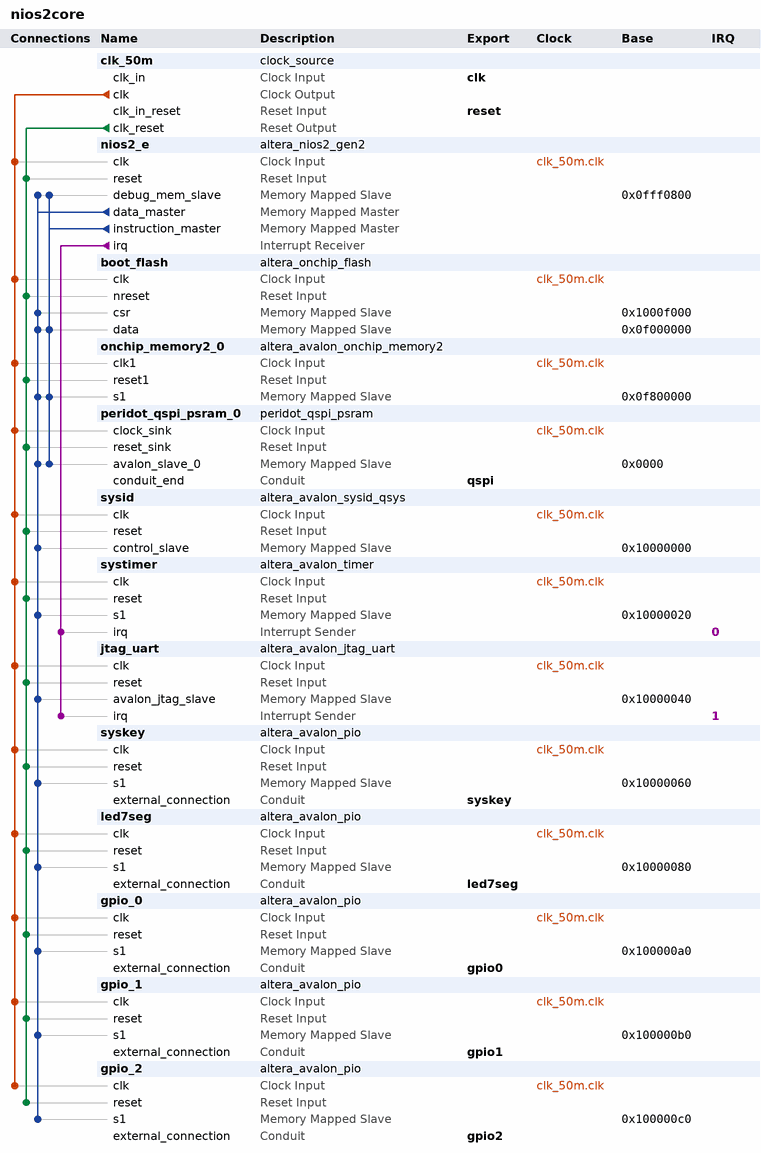
[diagram p0: system contents]
# Platform Designer (Qsys) system nios2core, MAX 10 10M08SCE144C8G
# Parameters at their usual value, and those the tool derives, are not listed.
package require -exact qsys 17.1
create_system nios2core
set_project_property DEVICE_FAMILY {MAX 10}
set_project_property DEVICE 10M08SCE144C8G

add_instance clk_50m clock_source 17.1
set_instance_parameter_value clk_50m clockFrequency 50000000

add_instance nios2_e altera_nios2_gen2 17.1
set_instance_parameter_value nios2_e dcache_size 2048
set_instance_parameter_value nios2_e exceptionSlave onchip_memory2_0.s1
set_instance_parameter_value nios2_e icache_size 4096
set_instance_parameter_value nios2_e impl Tiny
set_instance_parameter_value nios2_e resetSlave boot_flash.data

add_instance boot_flash altera_onchip_flash 17.1
set_instance_parameter_value boot_flash CONFIGURATION_MODE {Single Compressed Image}
set_instance_parameter_value boot_flash READ_BURST_COUNT 2
set_instance_parameter_value boot_flash SECTOR_ACCESS_MODE {Read and write,Read and write,Hidden,Read and write,Hidden}
set_instance_parameter_value boot_flash initFlashContent true
set_instance_parameter_value boot_flash initializationFileName boot_onchip_flash.hex
set_instance_parameter_value boot_flash initializationFileNameForSim boot_onchip_flash.dat
set_instance_parameter_value boot_flash useNonDefaultInitFile true

add_instance onchip_memory2_0 altera_avalon_onchip_memory2 17.1
set_instance_parameter_value onchip_memory2_0 dataWidth 32
set_instance_parameter_value onchip_memory2_0 dualPort false
set_instance_parameter_value onchip_memory2_0 initMemContent false
set_instance_parameter_value onchip_memory2_0 initializationFileName onchip_mem.hex
set_instance_parameter_value onchip_memory2_0 memorySize 16384

add_instance peridot_qspi_psram_0 peridot_qspi_psram 0.9
set_instance_parameter_value peridot_qspi_psram_0 CS_NEGATE_DELAY 2
set_instance_parameter_value peridot_qspi_psram_0 CS_NEGATE_HOLD 4
set_instance_parameter_value peridot_qspi_psram_0 INITIAL_WAIT_CYCLE 10
set_instance_parameter_value peridot_qspi_psram_0 QSPI_READ_WAIT_CYCLE 4
set_instance_parameter_value peridot_qspi_psram_0 READDATA_LATENCY 4
set_instance_parameter_value peridot_qspi_psram_0 SPI_READ_WAIT_CYCLE 6

add_instance sysid altera_avalon_sysid_qsys 17.1
set_instance_parameter_value sysid id 1923678208

add_instance systimer altera_avalon_timer 17.1
set_instance_parameter_value systimer period 1
set_instance_parameter_value systimer periodUnits MSEC

add_instance jtag_uart altera_avalon_jtag_uart 17.1
set_instance_parameter_value jtag_uart simInteractiveOptions NO_INTERACTIVE_WINDOWS

add_instance syskey altera_avalon_pio 17.1
set_instance_parameter_value syskey direction InOut
set_instance_parameter_value syskey width 3

add_instance led7seg altera_avalon_pio 17.1
set_instance_parameter_value led7seg direction Output
set_instance_parameter_value led7seg resetValue 16777215
set_instance_parameter_value led7seg width 24

add_instance gpio_0 altera_avalon_pio 17.1
set_instance_parameter_value gpio_0 direction Bidir
set_instance_parameter_value gpio_0 width 12

add_instance gpio_1 altera_avalon_pio 17.1
set_instance_parameter_value gpio_1 direction Bidir
set_instance_parameter_value gpio_1 width 12

add_instance gpio_2 altera_avalon_pio 17.1
set_instance_parameter_value gpio_2 direction Bidir
set_instance_parameter_value gpio_2 width 12

# connections
add_connection clk_50m.clk boot_flash.clk clock
add_connection clk_50m.clk gpio_0.clk clock
add_connection clk_50m.clk gpio_1.clk clock
add_connection clk_50m.clk gpio_2.clk clock
add_connection clk_50m.clk jtag_uart.clk clock
add_connection clk_50m.clk led7seg.clk clock
add_connection clk_50m.clk nios2_e.clk clock
add_connection clk_50m.clk onchip_memory2_0.clk1 clock
add_connection clk_50m.clk peridot_qspi_psram_0.clock_sink clock
add_connection clk_50m.clk sysid.clk clock
add_connection clk_50m.clk syskey.clk clock
add_connection clk_50m.clk systimer.clk clock
add_connection clk_50m.clk_reset boot_flash.nreset reset
add_connection clk_50m.clk_reset gpio_0.reset reset
add_connection clk_50m.clk_reset gpio_1.reset reset
add_connection clk_50m.clk_reset gpio_2.reset reset
add_connection clk_50m.clk_reset jtag_uart.reset reset
add_connection clk_50m.clk_reset led7seg.reset reset
add_connection clk_50m.clk_reset nios2_e.reset reset
add_connection clk_50m.clk_reset onchip_memory2_0.reset1 reset
add_connection clk_50m.clk_reset peridot_qspi_psram_0.reset_sink reset
add_connection clk_50m.clk_reset sysid.reset reset
add_connection clk_50m.clk_reset syskey.reset reset
add_connection clk_50m.clk_reset systimer.reset reset
add_connection nios2_e.data_master boot_flash.csr avalon
set_connection_parameter_value nios2_e.data_master/boot_flash.csr baseAddress 0x1000f000
add_connection nios2_e.data_master boot_flash.data avalon
set_connection_parameter_value nios2_e.data_master/boot_flash.data baseAddress 0x0f000000
add_connection nios2_e.data_master gpio_0.s1 avalon
set_connection_parameter_value nios2_e.data_master/gpio_0.s1 baseAddress 0x100000a0
add_connection nios2_e.data_master gpio_1.s1 avalon
set_connection_parameter_value nios2_e.data_master/gpio_1.s1 baseAddress 0x100000b0
add_connection nios2_e.data_master gpio_2.s1 avalon
set_connection_parameter_value nios2_e.data_master/gpio_2.s1 baseAddress 0x100000c0
add_connection nios2_e.data_master jtag_uart.avalon_jtag_slave avalon
set_connection_parameter_value nios2_e.data_master/jtag_uart.avalon_jtag_slave baseAddress 0x10000040
add_connection nios2_e.data_master led7seg.s1 avalon
set_connection_parameter_value nios2_e.data_master/led7seg.s1 baseAddress 0x10000080
add_connection nios2_e.data_master nios2_e.debug_mem_slave avalon
set_connection_parameter_value nios2_e.data_master/nios2_e.debug_mem_slave baseAddress 0x0fff0800
add_connection nios2_e.data_master onchip_memory2_0.s1 avalon
set_connection_parameter_value nios2_e.data_master/onchip_memory2_0.s1 baseAddress 0x0f800000
add_connection nios2_e.data_master peridot_qspi_psram_0.avalon_slave_0 avalon
set_connection_parameter_value nios2_e.data_master/peridot_qspi_psram_0.avalon_slave_0 baseAddress 0x0000
add_connection nios2_e.data_master sysid.control_slave avalon
set_connection_parameter_value nios2_e.data_master/sysid.control_slave baseAddress 0x10000000
add_connection nios2_e.data_master syskey.s1 avalon
set_connection_parameter_value nios2_e.data_master/syskey.s1 baseAddress 0x10000060
add_connection nios2_e.data_master systimer.s1 avalon
set_connection_parameter_value nios2_e.data_master/systimer.s1 baseAddress 0x10000020
add_connection nios2_e.instruction_master boot_flash.data avalon
set_connection_parameter_value nios2_e.instruction_master/boot_flash.data baseAddress 0x0f000000
add_connection nios2_e.instruction_master nios2_e.debug_mem_slave avalon
set_connection_parameter_value nios2_e.instruction_master/nios2_e.debug_mem_slave baseAddress 0x0fff0800
add_connection nios2_e.instruction_master onchip_memory2_0.s1 avalon
set_connection_parameter_value nios2_e.instruction_master/onchip_memory2_0.s1 baseAddress 0x0f800000
add_connection nios2_e.instruction_master peridot_qspi_psram_0.avalon_slave_0 avalon
set_connection_parameter_value nios2_e.instruction_master/peridot_qspi_psram_0.avalon_slave_0 baseAddress 0x0000
add_connection nios2_e.irq jtag_uart.irq interrupt
set_connection_parameter_value nios2_e.irq/jtag_uart.irq irqNumber 1
add_connection nios2_e.irq systimer.irq interrupt
set_connection_parameter_value nios2_e.irq/systimer.irq irqNumber 0

# exported interfaces
add_interface clk clock sink
set_interface_property clk EXPORT_OF clk_50m.clk_in
add_interface gpio0 conduit end
set_interface_property gpio0 EXPORT_OF gpio_0.external_connection
add_interface gpio1 conduit end
set_interface_property gpio1 EXPORT_OF gpio_1.external_connection
add_interface gpio2 conduit end
set_interface_property gpio2 EXPORT_OF gpio_2.external_connection
add_interface led7seg conduit end
set_interface_property led7seg EXPORT_OF led7seg.external_connection
add_interface qspi conduit end
set_interface_property qspi EXPORT_OF peridot_qspi_psram_0.conduit_end
add_interface reset reset sink
set_interface_property reset EXPORT_OF clk_50m.clk_in_reset
add_interface syskey conduit end
set_interface_property syskey EXPORT_OF syskey.external_connection

set_interconnect_requirement {$system} qsys_mm.clockCrossingAdapter HANDSHAKE
set_interconnect_requirement {$system} qsys_mm.enableEccProtection FALSE
set_interconnect_requirement {$system} qsys_mm.insertDefaultSlave FALSE
set_interconnect_requirement {$system} qsys_mm.maxAdditionalLatency 1

save_system nios2core.qsys
